# EAGLE design STM-ARDUINO-Power-board (EAGLE 9.5.2)
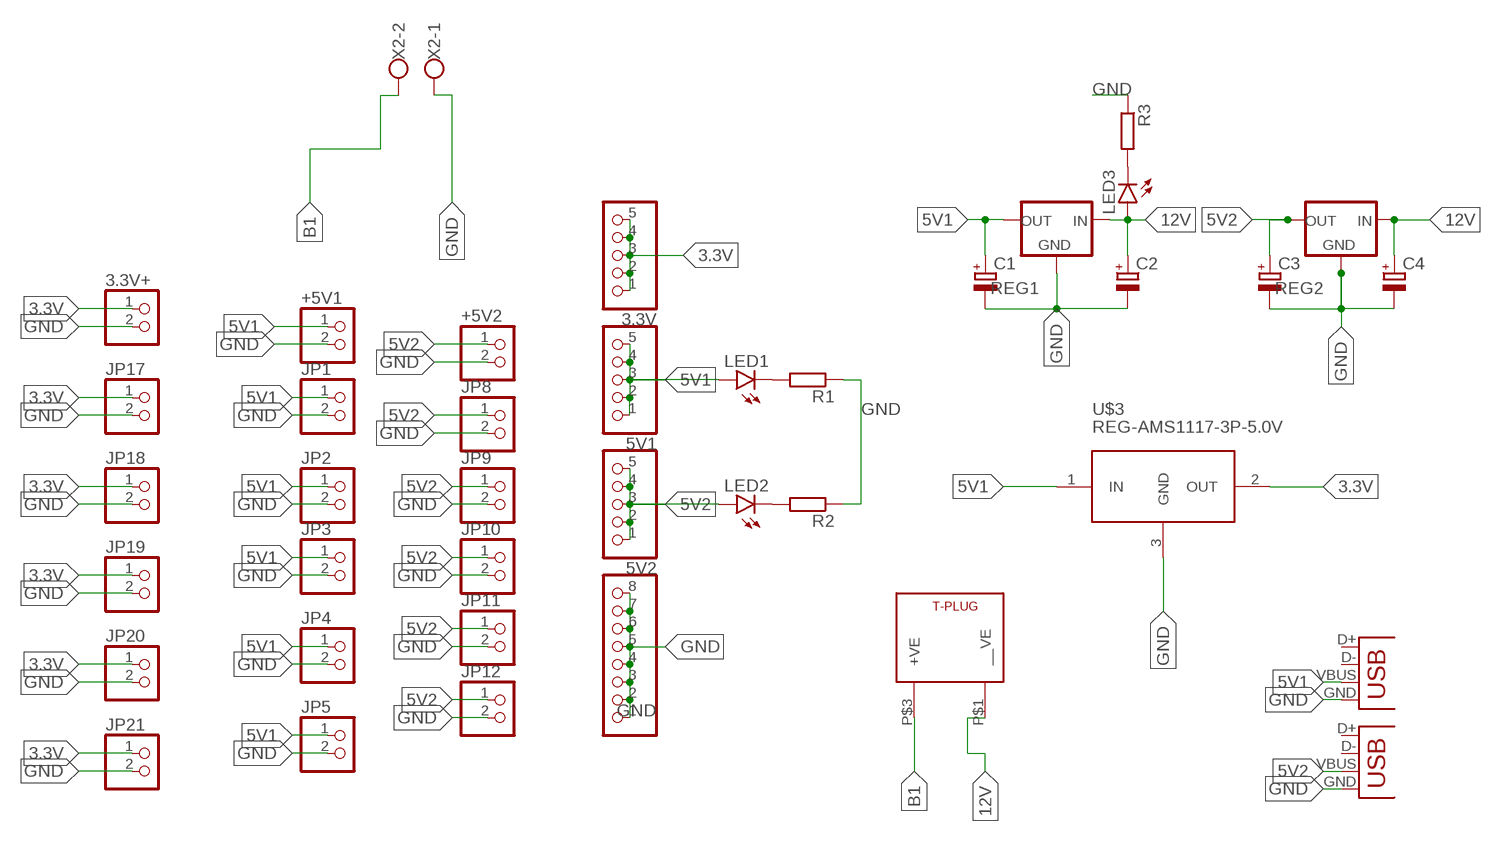
[diagram p0: schematic, sheet 1]

## Parts
3.3V  PINHD-1X5  [1X05]
3.3V+  PINHD-2_DATA  [1X02_DATA]
5V1  PINHD-1X5  [1X05]
5V2  PINHD-1X5  [1X05]
+5V1  PINHD-2_DATA  [1X02_DATA]
+5V2  PINHD-2_DATA  [1X02_DATA]
C1  CAP_POL  [E3,5-8]
C2  CAP_POL  [E3,5-8]
C3  CAP_POL  [E3,5-8]
C4  CAP_POL  [E3,5-8]
GND  PINHD-1X8  [1X08]
JP1  PINHD-2_DATA  [1X02_DATA]
JP2  PINHD-2_DATA  [1X02_DATA]
JP3  PINHD-2_DATA  [1X02_DATA]
JP4  PINHD-2_DATA  [1X02_DATA]
JP5  PINHD-2_DATA  [1X02_DATA]
JP8  PINHD-2_DATA  [1X02_DATA]
JP9  PINHD-2_DATA  [1X02_DATA]
JP10  PINHD-2_DATA  [1X02_DATA]
JP11  PINHD-2_DATA  [1X02_DATA]
JP12  PINHD-2_DATA  [1X02_DATA]
JP17  PINHD-2_DATA  [1X02_DATA]
JP18  PINHD-2_DATA  [1X02_DATA]
JP19  PINHD-2_DATA  [1X02_DATA]
JP20  PINHD-2_DATA  [1X02_DATA]
JP21  PINHD-2_DATA  [1X02_DATA]
LED1  LED5MM  [LED5MM]
LED2  LED5MM  [LED5MM]
LED3  LED5MM  [LED5MM]
R1  R-EU_0204/7  [0204/7]
R2  R-EU_0204/7  [0204/7]
R3  R-EU_0204/7  [0204/7]
REG1  78XX-METAL  [TO3-79]
REG2  78XX-METAL  [TO3-79]
U$3  REG-AMS1117-3P-5.0V  [REG-AMS1117-3P]
U$5  T_CONNECTOR  [T-PLUG]
USB1  USB-A-H  [USB-A-H]
USB2  USB-A-H  [USB-A-H]
X2  ROSTA.POWER  [W239-302]

## Nets
3.3V: 3.3V+.1 3.3V.1 3.3V.2 3.3V.3 3.3V.4 3.3V.5 JP17.1 JP18.1 JP19.1 JP20.1 JP21.1 U$3.2(OUT)
5V1: 5V1.1 5V1.2 5V1.3 5V1.4 5V1.5 +5V1.1 C1.+ JP1.1 JP2.1 JP3.1 JP4.1 JP5.1 LED1.A REG1.1(OUT) U$3.1(IN) USB1.VBUS
5V2: 5V2.1 5V2.2 5V2.3 5V2.4 5V2.5 +5V2.1 C3.+ JP8.1 JP9.1 JP10.1 JP11.1 JP12.1 LED2.A REG2.1(OUT) USB2.VBUS
12V: C2.+ C4.+ LED3.A REG1.3(IN) REG2.3(IN) U$5.P$1(__VE)
B1: U$5.P$3(+VE) X2.2
GND: 3.3V+.2 +5V1.2 +5V2.2 C1.- C2.- C3.- C4.- GND.1 GND.2 GND.3 GND.4 GND.5 GND.6 GND.7 GND.8 JP1.2 JP2.2 JP3.2 JP4.2 JP5.2 JP8.2 JP9.2 JP10.2 JP11.2 JP12.2 JP17.2 JP18.2 JP19.2 JP20.2 JP21.2 R1.1 R2.1 R3.1 REG1.2(GND) REG2.2(GND) U$3.3(GND) USB1.GND USB2.GND X2.1
N$1: LED1.K(C) R1.2
N$2: LED2.K(C) R2.2
N$3: LED3.K(C) R3.2
Unconnected: USB1.D+ USB1.D- USB2.D+ USB2.D-

## Library data of the parts
3.3V 5V1 5V2 = MIA_LIBRARY-2-2-2:PINHD-1X5: PIN HEADER
3.3V+ +5V1 +5V2 JP1-JP5 JP8-JP12 JP17-JP21 = MIA_LIBRARY-2-2-2:PINHD-2_DATA: PIN HEADER
C1-C4 = MIA_LIBRARY-2-2-2:CAP_POL
GND = MIA_LIBRARY-2-2-2:PINHD-1X8: PIN HEADER
LED1-LED3 = led:LED: LED OSRAM: - CHIPLED LG R971, LG N971, LY N971, LG Q971, LY Q971, LO R971, LY R971 LH N974, LH R974 LS Q976, LO Q976, LY Q976 LO Q996 - Hyper CHIPLED LW Q18S LB Q993, LB Q99A, LB R99A - SideLED LS A670, LO A670, LY A670, LG A670, LP A670 LB A673, LV A673, LT A673, LW A673 LH A674 LY A675 LS A676, LA A676, LO A676, LY A676, LW A676 LS A679, LY A679, LG A679 - Hyper Micro SIDELED® LS Y876, LA Y876, LO Y876, LY Y876 LT Y87S - SmartLED LW L88C, LW L88S LB L89C, LB L89S, LG L890 LS L89K, LO L89K, LY L89K LS L896, LA L896, LO L896, LY L896 - TOPLED LS T670, LO T670, LY T670, LG T670, LP T670 LSG T670, LSP T670, LSY T670, LOP T670, LYG T670 LG T671, LOG T671, LSG T671 LB T673, LV T673, LT T673, LW T673 LH T674 LS T676, LA T676, LO T676, LY T676, LB T676, LH T676, LSB T676, LW T676 LB T67C, LV T67C, LT T67C, LS T67K, LO T67K, LY T67K, LW E67C LS E67B, LA E67B, LO E67B, LY E67B, LB E67C, LV E67C, LT E67C LW T67C LS T679, LY T679, LG T679 LS T770, LO T770, LY T770, LG T770, LP T770 LB T773, LV T773, LT T773, LW T773 LH T774 LS E675, LA E675, LY E675, LS T675 LS T776, LA T776, LO T776, LY T776, LB T776 LHGB T686 LT T68C, LB T68C - Hyper Mini TOPLED® LB M676 - Mini TOPLED Santana® LG M470 LS M47K, LO M47K, LY M47K Source: http://www.osram.convergy.de LUXEON: - LUMILED® LXK2-PW12-R00, LXK2-PW12-S00, LXK2-PW14-U00, LXK2-PW14-V00 LXK2-PM12-R00, LXK2-PM12-S00, LXK2-PM14-U00 LXK2-PE12-Q00, LXK2-PE12-R00, LXK2-PE12-S00, LXK2-PE14-T00, LXK2-PE14-U00 LXK2-PB12-K00, LXK2-PB12-L00, LXK2-PB12-M00, LXK2-PB14-N00, LXK2-PB14-P00, LXK2-PB14-Q00 LXK2-PR12-L00, LXK2-PR12-M00, LXK2-PR14-Q00, LXK2-PR14-R00 LXK2-PD12-Q00, LXK2-PD12-R00, LXK2-PD12-S00 LXK2-PH12-R00, LXK2-PH12-S00 LXK2-PL12-P00, LXK2-PL12-Q00, LXK2-PL12-R00 Source: www.luxeon.com KINGBRIGHT: KA-3528ASYC Source: www.kingbright.com
R1-R3 = rcl:R-EU_: RESISTOR, European symbol; SPICEPREFIX: R
REG1 REG2 = MIA_LIBRARY-2-2-2:78XX-METAL: VOLTAGE REGULATOR
U$3 = MIA_LIBRARY-2-2-2:REG-AMS1117-3P-*: Linear Regulator based on AMS1117 chip 3-pin version AMS1117 datasheet is available here: http://www.advanced-monolithic.com/pdf/ds1117.pdf Click here to find device on ebay.com <http://www.ebay.com/sch/ams1117+module> Note: There are many variants. Search for the proper version.
U$5 = MIA_LIBRARY-2-2-2:T_CONNECTOR
USB1 USB2 = MIA_LIBRARY-2-2-2:USB: USB Connectors
X2 = MIA_LIBRARY-2-2-2:ROSTA.POWER: WAGO SCREW CLAMP; OC_FARNELL: unknown; OC_NEWARK: unknown

## Board
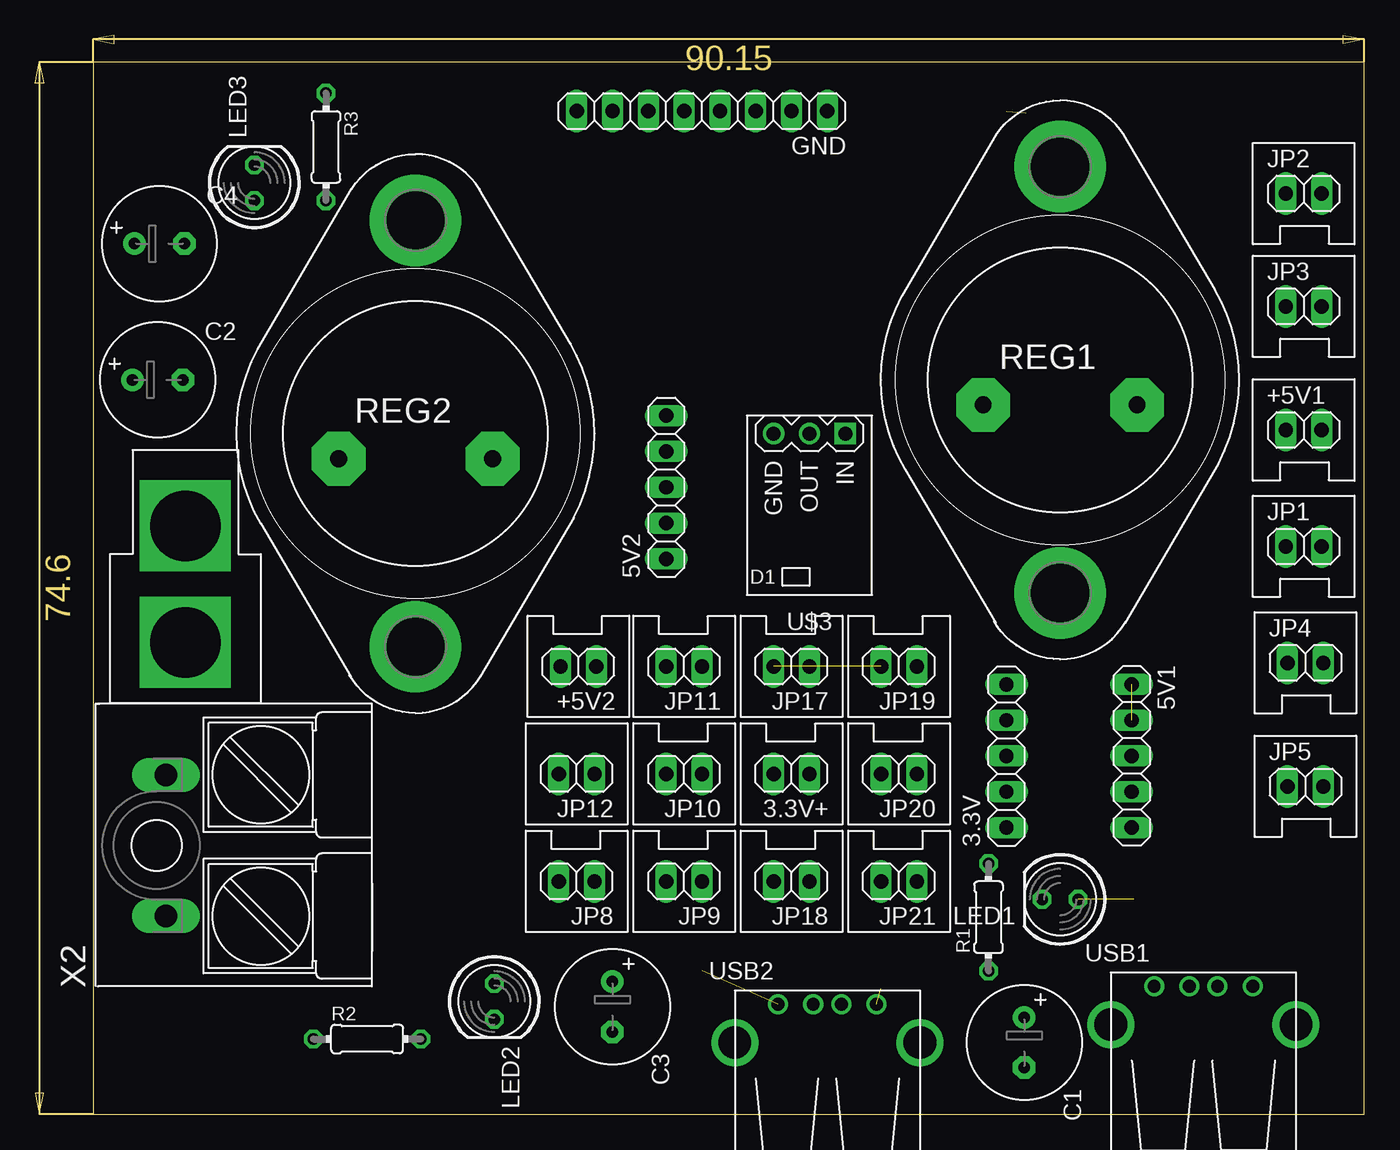
[diagram p1: board, top side]
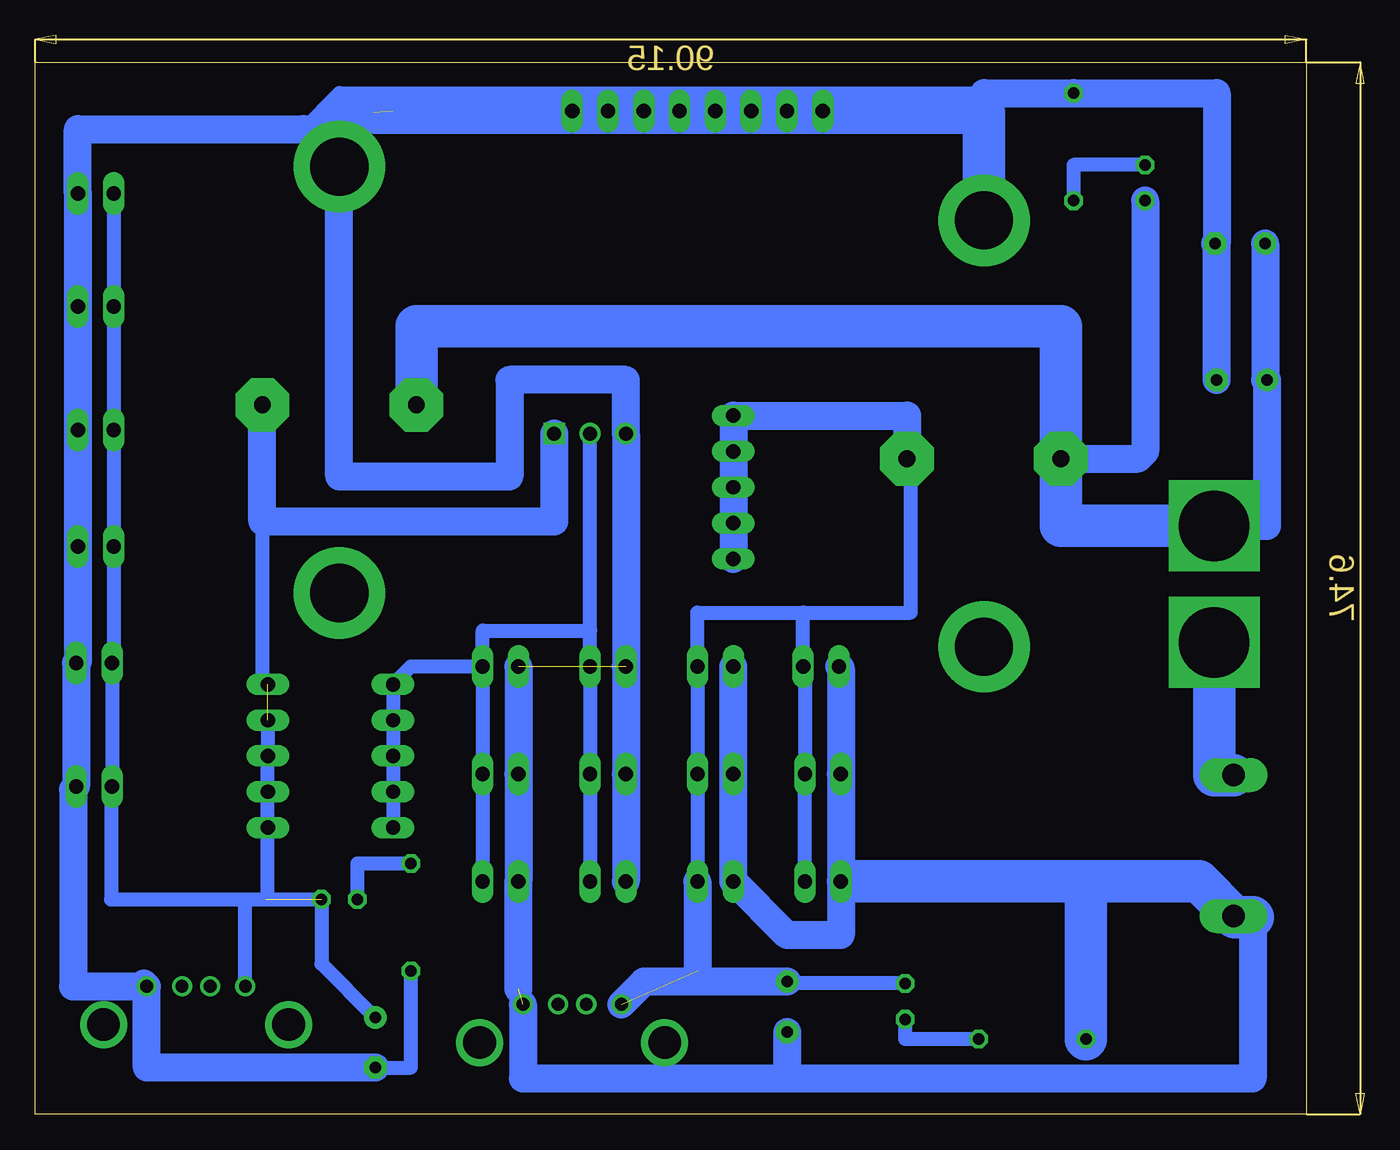
[diagram p2: board, bottom side, seen from below]

Size 90.15 x 74.6 mm. Coordinates in mm from the lower left corner, seen from the top.
Outline: 0,0 90.15,0 90.15,74.6 0,74.6 0,0
Copper layers (1*16): Top 0.035mm / dielectric 1.5mm / Bottom 0.035mm
Design rules "default": minimum track width 6mil, minimum drill 0.35mm, track to track 6mil, track to pad 6mil, pad to pad 6mil, via to via 6mil, smd to smd 6mil, copper to edge 40mil, drill to drill 6mil, minimum pad ring 10mil, minimum via ring 8mil, stop-mask expansion 4mil, vias tented up to drill 0mil, thermal gap 10mil

### Footprints (pad centres in the part's own frame; a part is rotated, then mirrored left to right if it is on the bottom)
1X05 = drill 1.016 long: 1 -5.08,0; 2 -2.54,0; 3 0,0; 4 2.54,0; 5 5.08,0
1X02_DATA = drill 1.016 long: 1 -1.27,0; 2 1.27,0
E3,5-8 = drill 0.813 pad 1.6: + -1.778,0 | drill 0.813 pad 1.6 octagon: - 1.778,0
1X08 = drill 1.016 long: 1 -8.89,0; 2 -6.35,0; 3 -3.81,0; 4 -1.27,0; 5 1.27,0; 6 3.81,0; 7 6.35,0; 8 8.89,0
LED5MM = drill 0.813 octagon: A -1.27,0; K 1.27,0
0204/7 = drill 0.813 octagon: 1 -3.81,0; 2 3.81,0
TO3-79 = drill 1.194 pad 3.81 octagon: 1 -1.778,-5.461; 3 -1.778,5.461 | drill 4.115 pad 6.477: 2 15.113,0; 3@ -15.113,0
REG-AMS1117-3P = drill 1 square: 1 -2.54,-5.08 | drill 1: 2 0,-5.08; 3 2.54,-5.08
T-PLUG = drill 5 pad 6.452 square: P$1 -2.73,-4; P$3 -11,-4
USB-A-H = drill 0.914: D+ 2.718,-1.003; D- 2.718,1.003; GND 2.718,-3.493; VBUS 2.718,3.493 | drill 2.311: P$5 0,-6.566; P$6 0,6.566
W239-302 = drill 1.6 long: 1 -5,5; 2 5,5

### Placement (x,y rotation side)
3.3V  64.77,25.4 90 top
3.3V+  49.53,24.13 180 top
5V1  73.66,25.4 270 top
5V2  40.64,44.45 90 top
+5V1  85.85,48.51 0 top
+5V2  34.42,31.75 180 top
C1  66.04,5.08 270 top
C2  4.57,52.07 0 top
C3  36.83,7.62 270 top
C4  4.7,61.72 0 top
GND  43.18,71.12 180 top
JP1  85.85,40.26 0 top
JP2  85.85,65.28 0 top
JP3  85.85,57.28 0 top
JP4  85.98,32 0 top
JP5  85.98,23.24 0 top
JP8  34.29,16.51 180 top
JP9  41.91,16.51 180 top
JP10  41.91,24.13 180 top
JP11  41.91,31.75 180 top
JP12  34.29,24.13 180 top
JP17  49.53,31.75 180 top
JP18  49.53,16.51 180 top
JP19  57.15,31.75 180 top
JP20  57.15,24.13 180 top
JP21  57.15,16.51 180 top
LED1  68.58,15.24 180 top
LED2  28.45,8 270 top
LED3  11.43,66.04 90 top
R1  63.5,13.97 90 top
R2  19.43,5.33 0 top
R3  16.51,68.58 270 top
REG1  68.58,52.07 90 top
REG2  22.86,48.26 90 top
U$3  50.8,43.18 180 top
U$5  2.54,44.45 90 top
USB1  78.74,6.35 90 top
USB2  52.07,5.08 90 top
X2  10.16,19.05 90 top

### Tracks (layer width: path | path; a pad name or v marks a point on that pad's centre or on a via)
3.3V
  Bottom 1: 50.8,34.29 JP17.1 3.3V+.1 JP18.1 | 50.8,34.29 U$3.2 | JP21.1 JP20.1 JP19.1 | JP19.1 58.42,34.29 50.8,34.29 | JP19.1 63.5,31.75 3.3V.5 3.3V.4 3.3V.3 3.3V.2 3.3V.1
5V1  (2 unrouted)
  Bottom 1: JP2.1 JP3.1 +5V1.1 JP1.1 84.58,32.13 JP4.1 JP5.1 84.77,23.18 84.77,15.24 73.8,15.24 | REG1.1 74.04,30.86 5V1.1 | 5V1.2 5V1.3 5V1.4 5V1.5 73.66,15.24 LED1.A | USB1.VBUS 75.25,15.24 LED1.A | C1.+ 69.85,10.67 LED1.A
  Bottom 2: U$3.1 53.34,42.04 74.04,42.04 REG1.1
5V2  (1 unrouted)
  Bottom 1: 35.69,35.56 +5V2.1 35.56,31.62 JP12.1 JP8.1 | REG2.1 28.07,46.23 28.07,35.56 35.69,35.56 | 43.18,15.24 JP9.1 JP10.1 JP11.1 43.18,35.56 35.69,35.56 | LED2.A 36.83,9.27 C3.+
  Bottom 2: 5V2.1 5V2.2 5V2.3 5V2.4 5V2.5 28.32,49.53 REG2.1 | USB2.VBUS 46.98,9.4 C3.+ | JP9.1 43.18,10.16
12V
  Bottom 2: U$5.P$1 2.79,41.72 C2.+ 2.92,52.07 C4.+ | LED3.A 11.43,46.99 11.94,46.48 REG2.3
  Bottom 3: REG1.3 63.12,55.88 17.4,55.88 REG2.3 17.4,41.72 U$5.P$1
B1
  Bottom 3: U$5.P$3 6.54,24.05 X2.2
GND  (3 unrouted)
  Bottom 1: C1.- 63.5,3.3 R1.1 | 71.12,69.85 68.58,72.39 22.99,72.39 22.86,72.26 REG2.2
  Bottom 2: REG1.2 68.58,69.85 71.12,69.85 87.12,69.85 JP2.2 JP3.2 +5V1.2 JP1.2 87.12,32.13 JP4.2 JP5.2 87.47,23.02 87.47,9.07 USB1.GND | JP8.2 JP12.2 33.02,31.62 +5V2.2 | JP11.2 JP10.2 JP9.2 36.83,12.7 33.02,12.7 JP8.2 | JP8.2 31.75,16.51 | JP18.2 3.3V+.2 JP17.2 U$3.3 48.26,52.07 56.51,52.07 56.51,45.21 68.58,45.21 REG1.2 | JP19.2 JP20.2 JP21.2 55.88,8.89 | USB1.GND 82.43,9.27 | USB2.GND 55.56,2.54 36.83,2.54 | 36.83,2.54 3.81,2.54 3.81,13.97 | C3.- 36.83,2.54 | C1.- 82.23,3.3 USB1.GND | C2.- 6.35,61.72 | C4.- 6.35,61.72 | 22.86,64.77 REG2.2 22.86,72.39 R3.1 6.35,72.39 6.35,61.72 | REG1.2 68.58,71.12 64.77,71.12
  Bottom 3: 66.17,70.99 31.75,70.99 | REG2.2 22.86,70.99 34.16,70.99 GND.8 GND.7 GND.6 GND.5 GND.4 GND.3 GND.2 GND.1 | 31.75,16.51 15.62,16.51 | 15.62,16.51 7.62,16.51 X2.1 5.08,13.97 3.81,13.97 | R2.1 15.62,16.51
N$1
  Bottom 1: LED1.K 67.31,17.78 R1.2
N$2
  Bottom 1: R2.2 28.45,5.33 LED2.K
N$3
  Bottom 1: LED3.K 16.51,67.31 R3.2